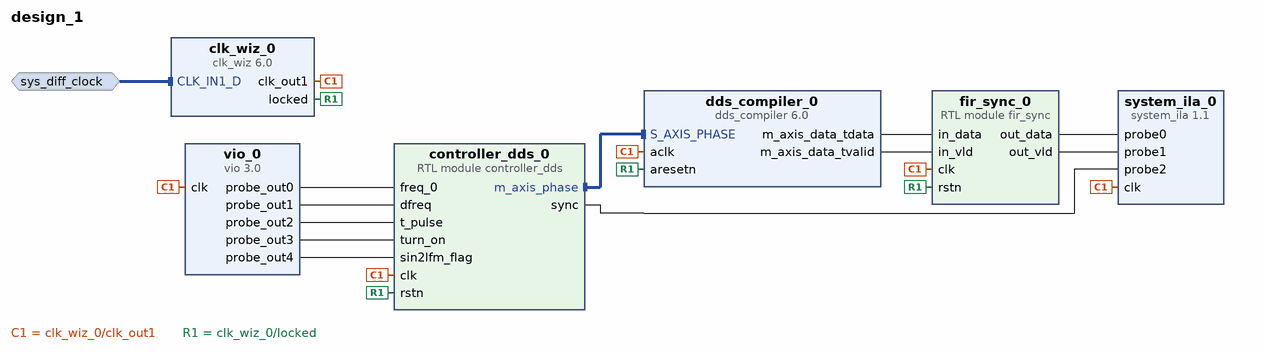
[diagram p0: block diagram of the top level]
# Vivado block design design_1, xc7z045ffg900-2, Vivado 2019.1.2
create_bd_design design_1

create_bd_intf_port -mode Slave -vlnv xilinx.com:interface:diff_clock_rtl:1.0 sys_diff_clock
set_property -dict {CONFIG.FREQ_HZ 200000000} [get_bd_intf_ports sys_diff_clock]

create_bd_cell -type module -reference fir_sync fir_sync_0
set_property -dict [list \
  CONFIG.MEM_FILE D:/work/radar_course/lesson_4/vivado/fir_sync/fir_sync.srcs/sources_1/imports/hdl/coef_lp.mem \
] [get_bd_cells fir_sync_0]
create_bd_cell -type module -reference controller_dds controller_dds_0
create_bd_cell -type ip -vlnv xilinx.com:ip:clk_wiz:6.0 clk_wiz_0
set_property -dict [list \
  CONFIG.CLKOUT1_JITTER 93.990 \
  CONFIG.CLKOUT1_REQUESTED_OUT_FREQ 250.000 \
  CONFIG.CLK_IN1_BOARD_INTERFACE sys_diff_clock \
  CONFIG.MMCM_CLKOUT0_DIVIDE_F 4.000 \
  CONFIG.USE_BOARD_FLOW true \
  CONFIG.USE_RESET false \
] [get_bd_cells clk_wiz_0]
create_bd_cell -type ip -vlnv xilinx.com:ip:vio:3.0 vio_0
set_property -dict [list \
  CONFIG.C_NUM_PROBE_IN 0 \
  CONFIG.C_NUM_PROBE_OUT 5 \
  CONFIG.C_PROBE_OUT0_WIDTH 32 \
  CONFIG.C_PROBE_OUT1_INIT_VAL 0x00000131 \
  CONFIG.C_PROBE_OUT1_WIDTH 32 \
  CONFIG.C_PROBE_OUT2_INIT_VAL 0x00010000 \
  CONFIG.C_PROBE_OUT2_WIDTH 32 \
  CONFIG.C_PROBE_OUT3_INIT_VAL 0x1 \
  CONFIG.C_PROBE_OUT4_INIT_VAL 0x1 \
] [get_bd_cells vio_0]
create_bd_cell -type ip -vlnv xilinx.com:ip:dds_compiler:6.0 dds_compiler_0
set_property -dict [list \
  CONFIG.DATA_Has_TLAST Not_Required \
  CONFIG.Has_ARESETn true \
  CONFIG.Has_Phase_Out false \
  CONFIG.M_DATA_Has_TUSER Not_Required \
  CONFIG.Noise_Shaping None \
  CONFIG.Output_Frequency1 0 \
  CONFIG.Output_Selection Cosine \
  CONFIG.Output_Width 8 \
  CONFIG.PINC1 0 \
  CONFIG.Parameter_Entry Hardware_Parameters \
  CONFIG.Phase_Increment Streaming \
  CONFIG.Phase_Width 16 \
  CONFIG.S_PHASE_Has_TUSER Not_Required \
] [get_bd_cells dds_compiler_0]
create_bd_cell -type ip -vlnv xilinx.com:ip:system_ila:1.1 system_ila_0
set_property -dict {CONFIG.C_DATA_DEPTH 4096 CONFIG.C_MON_TYPE NATIVE CONFIG.C_NUM_OF_PROBES 3} [get_bd_cells system_ila_0]

# ---- connections ----

connect_bd_intf_net [get_bd_intf_pins controller_dds_0/m_axis_phase] [get_bd_intf_pins dds_compiler_0/S_AXIS_PHASE]
connect_bd_intf_net [get_bd_intf_ports sys_diff_clock] [get_bd_intf_pins clk_wiz_0/CLK_IN1_D]
connect_bd_net [get_bd_pins clk_wiz_0/clk_out1] \
  [get_bd_pins vio_0/clk] [get_bd_pins fir_sync_0/clk] [get_bd_pins system_ila_0/clk] [get_bd_pins dds_compiler_0/aclk] \
  [get_bd_pins controller_dds_0/clk]
connect_bd_net [get_bd_pins vio_0/probe_out0] [get_bd_pins controller_dds_0/freq_0]
connect_bd_net [get_bd_pins vio_0/probe_out1] [get_bd_pins controller_dds_0/dfreq]
connect_bd_net [get_bd_pins vio_0/probe_out2] [get_bd_pins controller_dds_0/t_pulse]
connect_bd_net [get_bd_pins vio_0/probe_out3] [get_bd_pins controller_dds_0/turn_on]
connect_bd_net [get_bd_pins vio_0/probe_out4] [get_bd_pins controller_dds_0/sin2lfm_flag]
connect_bd_net [get_bd_pins clk_wiz_0/locked] [get_bd_pins fir_sync_0/rstn] [get_bd_pins controller_dds_0/rstn] [get_bd_pins dds_compiler_0/aresetn]
connect_bd_net [get_bd_pins dds_compiler_0/m_axis_data_tdata] [get_bd_pins fir_sync_0/in_data]
connect_bd_net [get_bd_pins dds_compiler_0/m_axis_data_tvalid] [get_bd_pins fir_sync_0/in_vld]
connect_bd_net [get_bd_pins fir_sync_0/out_data] [get_bd_pins system_ila_0/probe0]
connect_bd_net [get_bd_pins fir_sync_0/out_vld] [get_bd_pins system_ila_0/probe1]
connect_bd_net [get_bd_pins controller_dds_0/sync] [get_bd_pins system_ila_0/probe2]

validate_bd_design
save_bd_design
